# Altium schematic sheet Sch,SafetySystem.SchDoc
size B; SheetNumber: 1; SheetTotal: 1
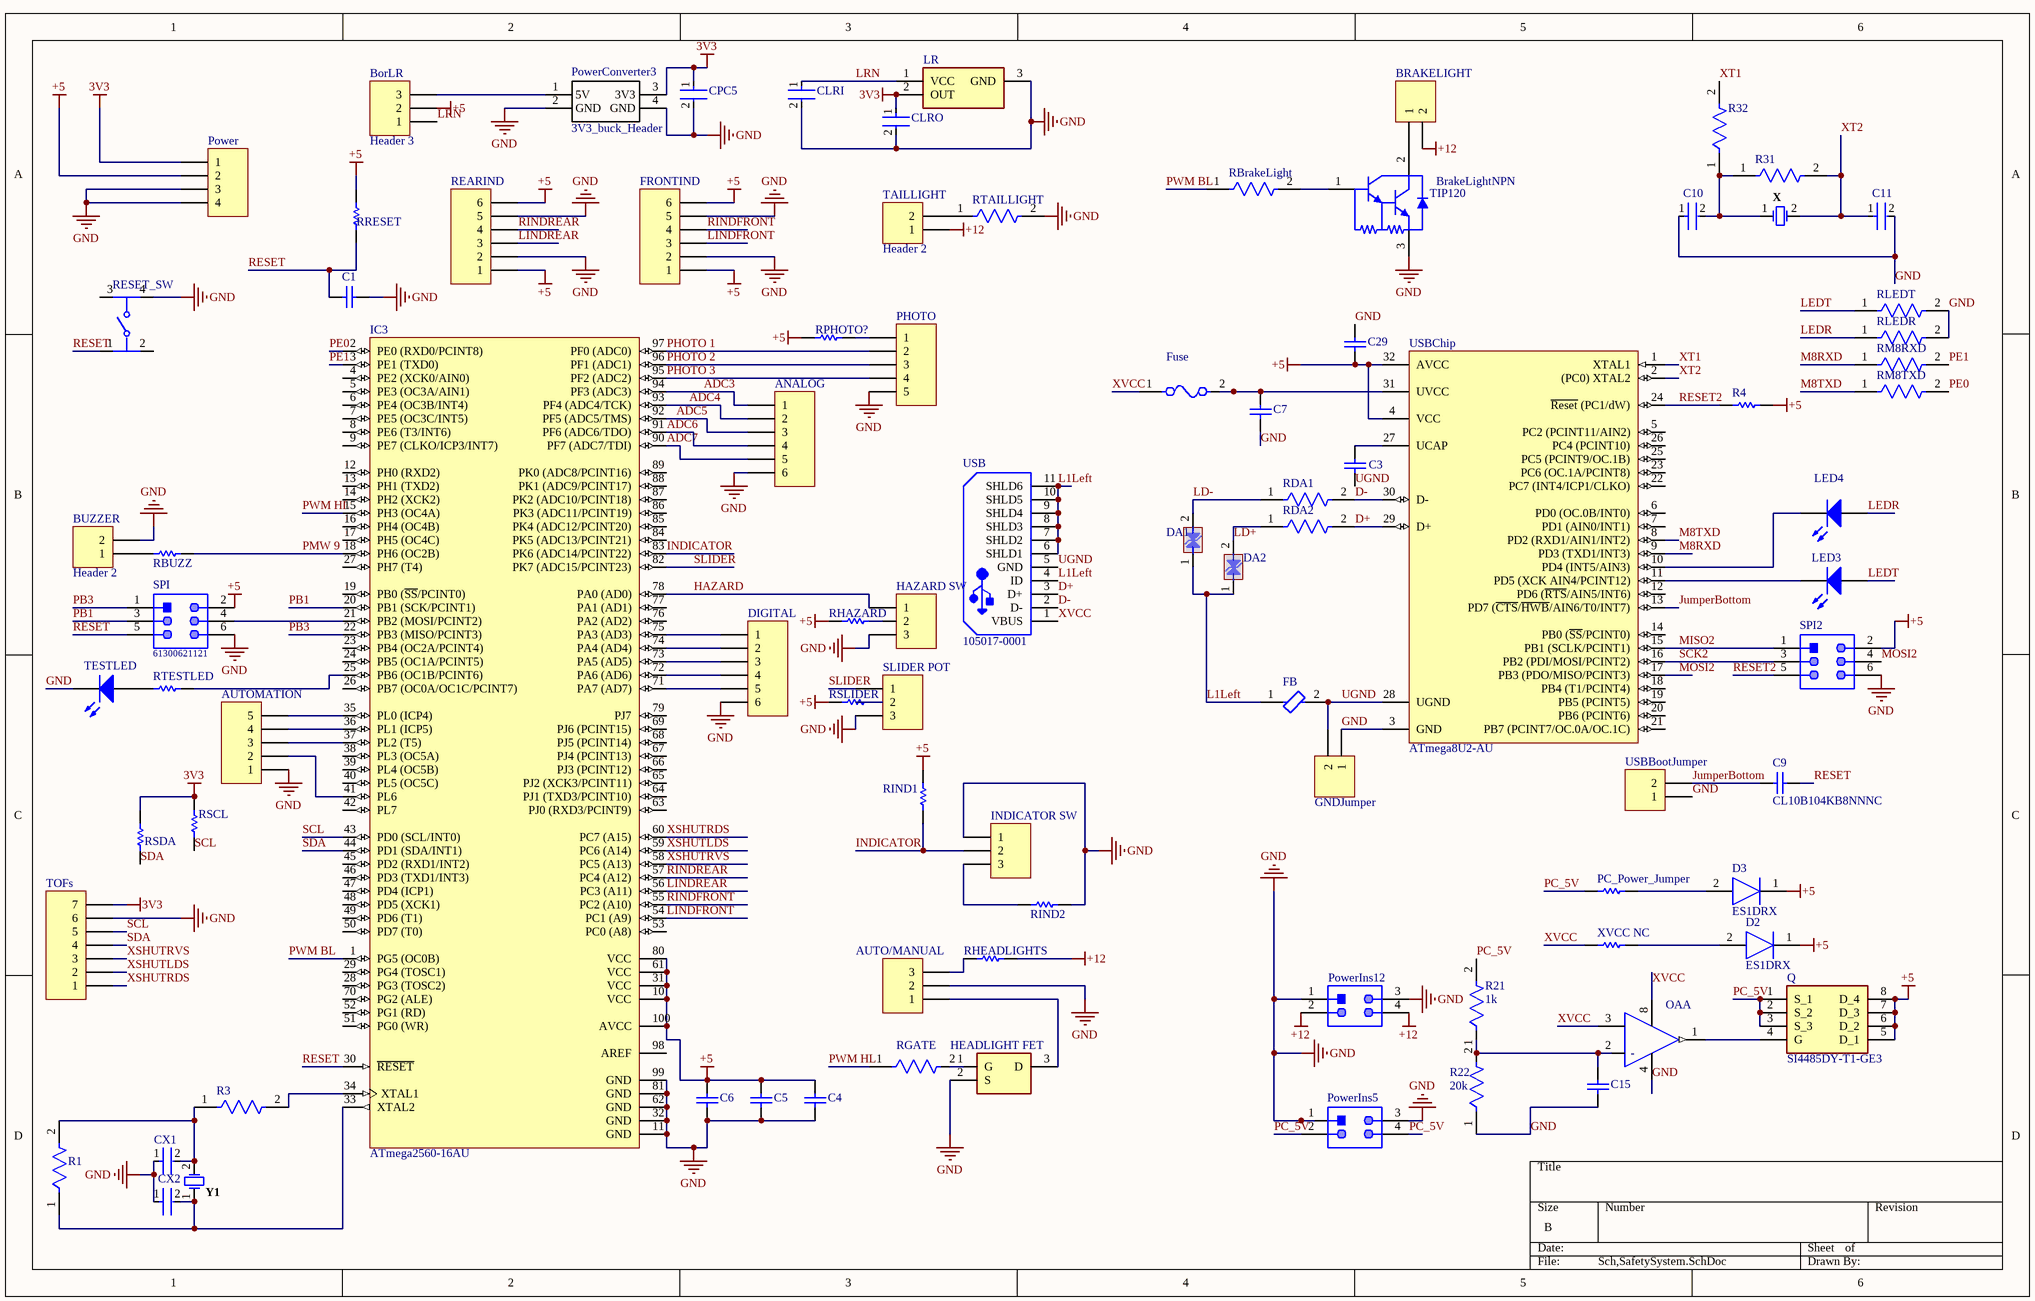
[diagram p0: Sch,SafetySystem.SchDoc]

## Parts
ANALOG  Header 6  [HDR1X6]  (value not drawn)
AUTO/MANUAL  (no value)  [HDR1X3]
AUTOMATION  Header 5  [HDR1X5]  (value not drawn)
BorLR  Header 3  [HDR1X3]
BRAKELIGHT  Header 2  [HDR1X2]  (value not drawn)
BrakeLightNPN  TIP120  [ONSC-TO-220-3-221A-09]
BUZZER  Header 2  [HDR1X2]
C1  GRM1885C1H220JA01D  [CAPC1608X90X35ML10T15]  (value not drawn)
C3  (no value)  [CAPC1608X90X35ML15T15]
C4  06035C104K4T2A  [CAPC1608X90X35ML15T15]  (value not drawn)
C5  06035C104K4T2A  [CAPC1608X90X35ML15T15]  (value not drawn)
C6  06035C104K4T2A  [CAPC1608X90X35ML15T15]  (value not drawn)
C7  06035C104K4T2A  [CAPC1608X90X35ML15T15]  (value not drawn)
C9  CL10B104KB8NNNC  [SAMS-C0603-2_M]
C10  C0603C220J5GACTU  [FP-C0603C-CF-MFG]  (value not drawn)
C11  C0603C220J5GACTU  [FP-C0603C-CF-MFG]  (value not drawn)
C15  06035C104K4T2A  [CAPC1608X90X35ML15T15]  (value not drawn)
C29  06035C104K4T2A  [CAPC1608X90X35ML15T15]  (value not drawn)
CLRI  C1608X5R1A106K080AC  [FP-C1608-080-MFG]  (value not drawn)
CLRO  C1608X5R1A106K080AC  [FP-C1608-080-MFG]  (value not drawn)
CPC5  C1608X5R1A106K080AC  [FP-C1608-080-MFG]  (value not drawn)
CX1  C0603C220J5GACTU  [FP-C0603C-CF-MFG]  (value not drawn)
CX2  C0603C220J5GACTU  [FP-C0603C-CF-MFG]  (value not drawn)
D2  ES1DRX  [SODFL3517X110N]
D3  ES1DRX  [SODFL3517X110N]
DA1  82356050101  [0603]  (value not drawn)
DA2  82356050101  [0603]  (value not drawn)
DIGITAL  Header 6  [HDR1X6]  (value not drawn)
FB  BLM18AG601SN1D  [FP-BLM18-0_15-t0_8-MFG]  (value not drawn)
FRONTIND  Header 6  [HDR1X6]  (value not drawn)
Fuse  0154.500DRT  [FP-0154-MFG]  (value not drawn)
GNDJumper  Header 2  [HDR1X2]  (value not drawn)
HAZARD_SW  (no value)  [HDR1X3]
HEADLIGHT_FET  ZXMN2B01F  [SOT95P237X112-3N]  (value not drawn)
IC3  ATmega2560-16AU  [100A_M]
INDICATOR_SW  SLIDER POT  [HDR1X3]  (value not drawn)
LED3  150060YS75000  [0603_A]  (value not drawn)
LED4  150060YS75000  [0603_A]  (value not drawn)
LR  BA033CC0FP-E2  [ROHM_TO-252-3]  (value not drawn)
OA  LM358DR  [FP-D0008A-MFG]  (value not drawn)  (part A of 2)
PC_Power_Jumper  CRCW06030000Z0EA  [RESC1609X50X30NL8T20]  (value not drawn)
PHOTO  Header 5  [HDR1X5]  (value not drawn)
Power  Header 4  [HDR1X4]  (value not drawn)
PowerConverter3  3V3_buck_Header  [PCBComponent_1]
PowerIns5  64900421122  [64900421122]  (value not drawn)
PowerIns12  64900421122  [64900421122]  (value not drawn)
Q  SI4485DY-T1-GE3  [SOIC127P600X175-8N]
R1  CRCW06031M00FKEA  [FP-CRCW0603-e3-MFG]  (value not drawn)
R3  CRCW060327R0FKEA  [FP-CRCW0603-e3-IPC_B]  (value not drawn)
R4  TNPW060310K0BEEA  [RESC1609X55X30NL10T20]  (value not drawn)
R21  1k  [FP-CRCW0603-e3-MFG]
R22  20k  [FP-CRCW0603-e3-IPC_C]
R31  (no value)  [FP-CRCW0603-e3-MFG]
R32  (no value)  [FP-CRCW0603-HPe3-IPC_B]
RBrakeLight  CRCW06031K00FKEA  [FP-CRCW0603-e3-MFG]  (value not drawn)
RBUZZ  CRCW06030000Z0EA  [RESC1609X50X30NL8T20]  (value not drawn)
RDA1  CRCW060322R0FKEA  [FP-CRCW0603-e3-IPC_B]  (value not drawn)
RDA2  CRCW060322R0FKEA  [FP-CRCW0603-e3-IPC_B]  (value not drawn)
REARIND  Header 6  [HDR1X6]  (value not drawn)
RESET_SW  B3FS-1000P  [FP-B3FS-1000P-MFG]  (value not drawn)
RGATE  CRCW060327R0FKEA  [FP-CRCW0603-e3-IPC_B]  (value not drawn)
RHAZARD  CRCW06030000Z0EA  [RESC1609X50X30NL8T20]  (value not drawn)
RHEADLIGHTS  CRCW06030000Z0EA  [RESC1609X50X30NL8T20]  (value not drawn)
RIND1  ERJ3EKF1002V  [RESC1609X55X30LL15T15]  (value not drawn)
RIND2  ERJ3EKF1002V  [RESC1609X55X30LL15T15]  (value not drawn)
RLEDR  ERA-3AEB102V  [FP-ERA3A-IPC_C]  (value not drawn)
RLEDT  ERA-3AEB102V  [FP-ERA3A-IPC_C]  (value not drawn)
RM8RXD  ERA-3AEB102V  [FP-ERA3A-IPC_C]  (value not drawn)
RM8TXD  ERA-3AEB102V  [FP-ERA3A-IPC_C]  (value not drawn)
RPHOTO?  10kohm  [RESC1609X50X30NL8T20]  (value not drawn)
RRESET  ERJ3EKF1002V  [RESC1609X55X30LL15T15]  (value not drawn)
RSCL  10kohm  [RESC1609X50X30NL8T20]  (value not drawn)
RSDA  CRCW06030000Z0EA  [RESC1609X50X30NL8T20]  (value not drawn)
RSLIDER  CRCW06030000Z0EA  [RESC1609X50X30NL8T20]  (value not drawn)
RTAILLIGHT  ERJ-3EKF10R0V  [FP-ERJ3EK-MFG]  (value not drawn)
RTESTLED  TNPW06031K00BEEA  [RESC1609X55X30LL10T20]  (value not drawn)
SLIDER_POT  SLIDER POT  [HDR1X3]  (value not drawn)
SPI  61300621121  [61300621121]
SPI2  61300621121  [61300621121]  (value not drawn)
TAILLIGHT  Header 2  [HDR1X2]
TESTLED  BlinkTestLED  [0603_A]  (value not drawn)
TOFs  Header 7  [HDR1X7]  (value not drawn)
USB  105017-0001  [USB-MICRO-B_V]
USBBootJumper  Header 2  [HDR1X2]  (value not drawn)
USBChip  ATmega8U2-AU  [32A_M]
X  FOXSLF/160-20  [FOX-FOXSLF160-20]  (value not drawn)
XVCC_NC  CRCW06030000Z0EA  [RESC1609X50X30NL8T20]  (value not drawn)
Y1  FOXSLF/160-20  [FOX-FOXSLF160-20]  (value not drawn)

## Nets
3V3: CLRO.1 CPC5.1 LR.2(OUT) Power.1 PowerConverter3.3(3V3) RSCL.1 RSDA.1 TOFs.7
+5: BorLR.2 C4.2 C5.2 C6.2 C29.1 D2.1(K) D3.1(K) FRONTIND.1 FRONTIND.6 IC3.10(VCC) IC3.31(VCC) IC3.61(VCC) IC3.80(VCC) IC3.100(AVCC) Power.2 Q.5(D_1) Q.6(D_2) Q.7(D_3) Q.8(D_4) R4.2 REARIND.1 REARIND.6 RHAZARD.1 RIND1.1 RPHOTO?.1 RRESET.2 RSLIDER.1 SPI.2 SPI2.2 USBChip.4(VCC) USBChip.32(AVCC)
+12: BRAKELIGHT.2 PowerIns12.2 PowerIns12.4 RHEADLIGHTS.2 TAILLIGHT.1
GND: ANALOG.6 AUTO/MANUAL.2 AUTOMATION.1 BrakeLightNPN.3(E) BUZZER.2 C1.2 C4.1 C5.1 C6.1 C7.1 C10.1 C11.2 C15.1 C29.2 CLRI.2 CLRO.2 CPC5.2 CX1.1 CX2.1 DIGITAL.6 FRONTIND.2 FRONTIND.5 GNDJumper.1 HAZARD_SW.3 HEADLIGHT_FET.2(S) IC3.11(GND) IC3.32(GND) IC3.62(GND) IC3.81(GND) IC3.99(GND) INDICATOR_SW.1 LR.3(GND) OA.4(V-) PHOTO.5 Power.3 Power.4 PowerConverter3.2(GND) PowerConverter3.4(GND) PowerIns5.1 PowerIns5.3 PowerIns12.1 PowerIns12.3 R22.1 REARIND.2 REARIND.5 RESET_SW.4 RIND2.2 RLEDR.2 RLEDT.2 RTAILLIGHT.2 SLIDER_POT.3 SPI.6 SPI2.6 TESTLED.1(K) TOFs.6 USBBootJumper.1 USBChip.3(GND)
ADC3: ANALOG.1 IC3.94(PF3_(ADC3))
ADC4: ANALOG.2 IC3.93(PF4_(ADC4/TCK))
ADC5: ANALOG.3 IC3.92(PF5_(ADC5/TMS))
ADC6: ANALOG.4 IC3.91(PF6_(ADC6/TDO))
ADC7: ANALOG.5 IC3.90(PF7_(ADC7/TDI))
D+: RDA2.2 USB.3(D+) USBChip.29(D+)
D-: RDA1.2 USB.2(D-) USBChip.30(D-)
HAZARD: HAZARD_SW.1 IC3.78(PA0_(AD0))
INDICATOR: IC3.83(PK6_(ADC14/PCINT22)) INDICATOR_SW.2 RIND1.2
JumperBottom: C9.1 USBBootJumper.2 USBChip.13(PD7_(~{CTS}/~{HWB}/AIN6/T0/INT7))
L1Left: DA1.1(I/O1) DA2.1(I/O1) FB.1 USB.4(ID) USB.6(SHLD1) USB.7(SHLD2) USB.8(SHLD3) USB.9(SHLD4) USB.10(SHLD5) USB.11(SHLD6)
LD+: DA2.2(I/O2) RDA2.1
LD-: DA1.2(I/O2) RDA1.1
LEDR: LED4.2(A) RLEDR.1
LEDT: LED3.2(A) RLEDT.1
LINDFRONT: FRONTIND.3 IC3.54(PC1_(A9))
LINDREAR: IC3.56(PC3_(A11)) REARIND.3
LRN: BorLR.1 CLRI.1 LR.1(VCC)
M8RXD: RM8RXD.1 USBChip.9(PD3_(TXD1/INT3))
M8TXD: RM8TXD.1 USBChip.8(PD2_(RXD1/AIN1/INT2))
MISO2: SPI2.1 USBChip.15(PB1_(SCLK/PCINT1))
MOSI2: SPI2.4 USBChip.17(PB3_(PDO/MISO/PCINT3))
PB1: IC3.20(PB1_(SCK/PCINT1)) SPI.3
PB3: IC3.22(PB3_(MISO/PCINT3)) SPI.1
PC_5V: PC_Power_Jumper.1 PowerIns5.2 PowerIns5.4 Q.1(S_1) Q.2(S_2) Q.3(S_3) R21.2
PE0: IC3.2(PE0_(RXD0/PCINT8)) RM8TXD.2
PE1: IC3.3(PE1_(TXD0)) RM8RXD.2
PHOTO 1: IC3.97(PF0_(ADC0)) PHOTO.2
PHOTO 2: IC3.96(PF1_(ADC1)) PHOTO.3
PHOTO 3: IC3.95(PF2_(ADC2)) PHOTO.4
PMW 9: IC3.18(PH6_(OC2B)) RBUZZ.1
PWM BL: IC3.1(PG5_(OC0B)) RBrakeLight.1
PWM HL: IC3.15(PH3_(OC4A)) RGATE.1
RESET: C1.1 C9.2 IC3.30(~{RESET}) RESET_SW.1 RRESET.1 SPI.5
RESET2: R4.1 SPI2.5 USBChip.24(~{Reset}_(PC1/dW))
RINDFRONT: FRONTIND.4 IC3.55(PC2_(A10))
RINDREAR: IC3.57(PC4_(A12)) REARIND.4
SCK2: SPI2.3 USBChip.16(PB2_(PDI/MOSI/PCINT2))
SCL: IC3.43(PD0_(SCL/INT0)) RSCL.2 TOFs.5
SDA: IC3.44(PD1_(SDA/INT1)) RSDA.2 TOFs.4
SLIDER: IC3.82(PK7_(ADC15/PCINT23)) SLIDER_POT.1
UGND: C3.1 FB.2 GNDJumper.2 USB.5(GND) USBChip.28(UGND)
XSHUTLDS: IC3.59(PC6_(A14)) TOFs.2
XSHUTRDS: IC3.60(PC7_(A15)) TOFs.1
XSHUTRVS: IC3.58(PC5_(A13)) TOFs.3
XT1: R32.2 USBChip.1(XTAL1)
XT2: C11.1 R31.2 USBChip.2((PC0)_XTAL2) X.2
XVCC: Fuse.1 OA.3(IN1+) OA.8(V+) USB.1(VBUS) XVCC_NC.1
NetAUTO/MANUAL_1: AUTO/MANUAL.1 HEADLIGHT_FET.3(D)
NetAUTO/MANUAL_3: AUTO/MANUAL.3 RHEADLIGHTS.1
NetAUTOMATION_2: AUTOMATION.2 IC3.41(PL6)
NetAUTOMATION_3: AUTOMATION.3 IC3.37(PL2_(T5))
NetAUTOMATION_4: AUTOMATION.4 IC3.36(PL1_(ICP5))
NetAUTOMATION_5: AUTOMATION.5 IC3.35(PL0_(ICP4))
NetBorLR_3: BorLR.3 PowerConverter3.1(5V)
NetBRAKELIGHT_1: BRAKELIGHT.1 BrakeLightNPN.2(C)
NetBrakeLightNPN_1: BrakeLightNPN.1(B) RBrakeLight.2
NetBUZZER_1: BUZZER.1 RBUZZ.2
NetC3_2: C3.2 USBChip.27(UCAP)
NetC7_2: C7.2 Fuse.2 USBChip.31(UVCC)
NetC10_2: C10.2 R31.1 R32.1 X.1
NetC15_2: C15.2 OA.2(IN1-) R21.1 R22.2
NetCX1_2: CX1.2 R1.2 R3.1 Y1.2
NetCX2_2: CX2.2 IC3.33(XTAL2) R1.1 Y1.1
NetD2_2: D2.2(A) XVCC_NC.2
NetD3_2: D3.2(A) PC_Power_Jumper.2
NetDIGITAL_1: DIGITAL.1 IC3.75(PA3_(AD3))
NetDIGITAL_2: DIGITAL.2 IC3.74(PA4_(AD4))
NetDIGITAL_3: DIGITAL.3 IC3.73(PA5_(AD5))
NetDIGITAL_4: DIGITAL.4 IC3.72(PA6_(AD6))
NetDIGITAL_5: DIGITAL.5 IC3.71(PA7_(AD7))
NetHAZARD_SW_2: HAZARD_SW.2 RHAZARD.2
NetHEADLIGHT_FET_1: HEADLIGHT_FET.1(G) RGATE.2
NetIC3_21: IC3.21(PB2_(MOSI/PCINT2)) SPI.4
NetIC3_25: IC3.25(PB6_(OC1B/PCINT6)) RTESTLED.2
NetIC3_34: IC3.34(XTAL1) R3.2
NetINDICATOR_SW_3: INDICATOR_SW.3 RIND2.1
NetLED3_1: LED3.1(K) USBChip.11(PD5_(XCK_AIN4/PCINT12))
NetLED4_1: LED4.1(K) USBChip.10(PD4_(INT5/AIN3))
NetOA_1: OA.1(1OUT) Q.4(G)
NetPHOTO_1: PHOTO.1 RPHOTO?.2
NetRSLIDER_2: RSLIDER.2 SLIDER_POT.2
NetRTAILLIGHT_1: RTAILLIGHT.1 TAILLIGHT.2
NetRTESTLED_1: RTESTLED.1 TESTLED.2(A)

Not connected (* = marked no-connect by the designer): IC3 4(PE2_(XCK0/AIN0)) 5(PE3_(OC3A/AIN1)) 6(PE4_(OC3B/INT4)) 7(PE5_(OC3C/INT5)) 8(PE6_(T3/INT6)) 9(PE7_(CLKO/ICP3/INT7)) 12(PH0_(RXD2)) 13(PH1_(TXD2)) 14(PH2_(XCK2)) 16(PH4_(OC4B)) 17(PH5_(OC4C)) 19(PB0_(~{SS}/PCINT0)) 23(PB4_(OC2A/PCINT4)) 24(PB5_(OC1A/PCINT5)) 26(PB7_(OC0A/OC1C/PCINT7)) 27(PH7_(T4)) 28(PG3_(TOSC2)) 29(PG4_(TOSC1)) 38(PL3_(OC5A)) 39(PL4_(OC5B)) 40(PL5_(OC5C)) 42(PL7) 45(PD2_(RXD1/INT2)) 46(PD3_(TXD1/INT3)) 47(PD4_(ICP1)) 48(PD5_(XCK1)) 49(PD6_(T1)) 50(PD7_(T0)) 51(PG0_(WR)) 52(PG1_(RD)) 53(PC0_(A8)) 63(PJ0_(RXD3/PCINT9)) 64(PJ1_(TXD3/PCINT10)) 65(PJ2_(XCK3/PCINT11)) 66(PJ3_(PCINT12)) 67(PJ4_(PCINT13)) 68(PJ5_(PCINT14)) 69(PJ6_(PCINT15)) 70(PG2_(ALE)) 76(PA2_(AD2)) 77(PA1_(AD1)) 79(PJ7) 84(PK5_(ADC13/PCINT21)) 85(PK4_(ADC12/PCINT20)) 86(PK3_(ADC11/PCINT19)) 87(PK2_(ADC10/PCINT18)) 88(PK1_(ADC9/PCINT17)) 89(PK0_(ADC8/PCINT16)) 98(AREF); RESET_SW 2 3; USBChip 5(PC2_(PCINT11/AIN2)) 6(PD0_(OC.0B/INT0)) 7(PD1_(AIN0/INT1)) 12(PD6_(~{RTS}/AIN5/INT6)) 14(PB0_(~{SS}/PCINT0)) 18(PB4_(T1/PCINT4)) 19(PB5_(PCINT5)) 20(PB6_(PCINT6)) 21(PB7_(PCINT7/OC.0A/OC.1C)) 22(PC7_(INT4/ICP1/CLKO)) 23(PC6_(OC.1A/PCINT8)) 25(PC5_(PCINT9/OC.1B)) 26(PC4_(PCINT10))

## Notes on the sheet
- (in symbol CMP-1685-00009-2, part A) -

## Library data of the parts
ANALOG DIGITAL FRONTIND REARIND = Header 6: Header, 6-Pin; LatestRevisionDate: 17-Jul-2002; LatestRevisionNote: Re-released for DXP Platform.; Publisher: Altium Limited
AUTO/MANUAL BorLR HAZARD_SW INDICATOR_SW SLIDER_POT = Header 3: Header, 3-Pin; LatestRevisionDate: 17-Jul-2002; LatestRevisionNote: Re-released for DXP Platform.; Publisher: Altium Limited
AUTOMATION PHOTO = Header 5: Header, 5-Pin; LatestRevisionDate: 17-Jul-2002; LatestRevisionNote: Re-released for DXP Platform.; Publisher: Altium Limited
BRAKELIGHT BUZZER GNDJumper TAILLIGHT USBBootJumper = Header 2: Header, 2-Pin; LatestRevisionDate: 17-Jul-2002; LatestRevisionNote: Re-released for DXP Platform.; Publisher: Altium Limited
BrakeLightNPN = CMP-1047-00140-1: Plastic Medium-Power, Complementary Silicon Transistor, 3-Pin TO-220, Tube; Manufacturer: On Semiconductor; IC Continuous (A): 5; Polarity: NPN; ComponentLink2URL: http://www.onsemi.cn/pub_link/Collateral/TIP120-D.PDF; Packing: Tube; PartNumber: TIP120; ComponentLink3Description: Package Specification; PackageDescription: 3-Pin Flange Mount, Vertical Straight Lead, Body 9.97 x 4.445 mm, Pitch 2.54 mm; Mounting Technology: Through Hole; ComponentLink1URL: http://www.onsemi.com/; PackageVersion: Rev. AG, 09/2011; ComponentLink1Description: Manufacturer URL; PackageReference: TO-220-3-221A-09; ComponentLink2Description: Datasheet; RoHS: FALSE; DatasheetVersion: Rev. 8; ComponentLink3URL: http://www.onsemi.com/pub_link/Collateral/221A-09.PDF
C1 = CMP-2000-04945-1: Chip Capacitor, 22 pF, +/- 5%, 50 V, -55 to 125 degC, 0603 (1608 Metric), RoHS, Tape and Reel; Manufacturer: Murata; Capacitance: 22pF; Rated Voltage: 50V; Dielectric: C0G; Manufacturer URL: http://www.murata.com/; Datasheet Version: Jul-06; Package Reference: 603; Tolerance (%): ±5%; Case Size/Dimension: 0603; Package Description: 2-Pin Surface Mount Device, Body 1.6 x 0.8 mm; Datasheet URL: https://datasheet.ciiva.com/11786/0900766b807a1cab-11786398.pdf
C3 = CMP-2006-04386-1: Part Number: 06035C104K4T2A; Manufacturer: AVX Interconnect / Elco
C4-C7 C15 C29 = CMP-2006-04386-1: Manufacturer: AVX Interconnect / Elco; Part Number: 06035C104K4T2A
C9 = CMP-2000-05332-1: Multi-layer Ceramic Capacitor, -55 to 125 degC, 2-Pin SMD (0603), RoHS, Tape and Reel; Manufacturer: Samsung Electro-Mechanics; Capacitance: 0.1µF; Rated Voltage: 50V; Dielectric: X7R; Tolerance (%): ±10%; Case Size/Dimension: 0603; Datasheet URL: https://datasheet.ciiva.com/29198/456651-da-01-en-vs-kondensator-0605-29198839.pdf; Manufacturer URL: http://www.samsungsem.com/global/index.jsp; Datasheet Version: Nov-10
C10 C11 CX1 CX2 = CMP-2006-03119-3: Cap Ceramic 22pF 50V C0G 5% SMD 0603 125°C Paper T/R; Manufacturer: KEMET; Temperature Coefficient: 30ppm/°C; Automotive Grade: Grade 1; Tolerance: 0.05; RoHS: TRUE; Temperature Characteristic: C0G; Capacitance: 22 pF; Device Class L3: Ceramic Capacitors; Digikey Description: Cap Ceramic 22pF 50V C0G 5% SMD 0603 125°C Paper T/R; ComponentLink2URL: https://api.kemet.com/component-edge/download/datasheet/C0603C100J5GACAUTO.pdf; ComponentLink2Description: Datasheet; Automotive: Yes; Temperature: -55°C to +125°C; Temperature Range High: +125°C; Package: C0603C-CF; Device Class L1: Passive Components; Device Class L2: Capacitors; Lead Free: Yes; Value: 22 pF; Manufacturer Part Number: C0603C220J5GACTU; Category: Cap; Mouser Description: Cap Ceramic 22pF 50V C0G 5% SMD 0603 125°C Paper T/R; Voltage Rating: 50 V; Height: 0.87mm; Material: Ceramic; Temperature Range Low: -55°C; Octopart: https://octopart.com/c0603c220j5gactu-kemet-98525
CLRI CLRO CPC5 = CMP-2000-04979-2: CAP CER 10UF 10V X5R 0603; Manufacturer: TDK; Temperature Coefficient: 15%; Tolerance: 10%; Mouser Description: CAP CER 10UF 10V X5R 0603; Package: C1608-080; Lead Free: Yes; Device Class L1: Passive Components; Value: 10uF; Temperature Range High: +85°C; Manufacturer Part Number: C1608X5R1A106K080AC; Octopart: https://octopart.com/c1608x5r1a106k080ac-tdk-26013468; Voltage: 10V; Footprint Url: https://product.tdk.com/info/en/catalog/spec/mlccspec_commercial_general_midvoltage_en.pdf; Ipc Land Pattern Name: CAPC16080X80; Temperature Range Low: -55°C; Temperature: -55°C to +85°C; ComponentLink2Description: Datasheet; ComponentLink2URL: https://product.tdk.com/info/en/documents/chara_sheet/C1608X5R1A106K080AC.pdf; Height: 0.9mm; Temperature Characteristic: X5R; RoHS: TRUE; Category: Cap; Capacitance: 10uF; Digikey Description: CAP CER 10UF 10V X5R 0603; Automotive: No; Device Class L3: Ceramic Capacitors; Material: Ceramic; Device Class L2: Capacitors; Voltage Rating: 10V
D2 D3 = ES1DRX: Diode; Manufacturer_Name: Nexperia; Datasheet Link: http://www.farnell.com/datasheets/2363499.pdf; Height: 1.1mm; Manufacturer_Part_Number: ES1DRX; Mouser Part Number: N/A; Mouser Price/Stock: https://www.mouser.com/Search/Refine.aspx?Keyword=N%2FA; Arrow Part Number: ES1DRX; Arrow Price/Stock: https://www.arrow.com/en/products/es1drx/nexperia
DA1 DA2 = CMP-1422-00010-1: ESD Suppressor WE-VE,VDC=5.0V; Manufacturer: Wuerth Elektronik; Reverse Stand Off Voltage: 5.0V; ComponentLink2URL: http://katalog.we-online.de/kataloge/eisos/media/pdf/82356050101.pdf; PackageReference: 0603; PartNumber: 82356050101; ComponentLink1URL: http://www.we-online.com; ComponentLink1Description: Manufacturer URL; ComponentLink2Description: Datasheet
FB = CMP-0686-00436-3: Chip Ferrite Bead, 0603, 600Ω @ 100MHz, 0.38Ω, 25%, 500mA; Number of Lines: 1; Impedance: 600R; DC Resistance (DCR): 380mR; Shielding: Unshielded; Max DC Current: 500mA; Termination: SMD/SMT; Military Standard: Not; Number of Circuits: 1; Min Operating Temperature: -55°C; Case Code (Imperial): 0603; Width: 0.8mm; Current Rating: 500mA; Lead Free: Lead Free; Packaging: Tape and Reel; Frequency: 100MHz; Max Operating Temperature: 125°C; DC Current: 500mA; REACH SVHC: No SVHC; Case/Package: 0603; Package Quantity: 1; Height: 0.8mm; Number of Pins: 2; Depth: 0.8mm; Test Frequency: 100MHz; Case Code (Metric): 1608; Tolerance: 25%; Core Material: Ferrite; Weight: 7.1E-05oz; Material: Steel; Max Current Rating: 500mA; Radiation Hardening: No; Length: 1.6mm; RoHS Compliant: Yes
Fuse = CMP-08605-000021-1: FUSE BOARD MNT 500MA 125VAC/VDC; Manufacturer: Littelfuse; Max Fuse Ac Voltage: 125V; Fuse Blow Speed: Slow; Fuse Current: 0.5A; Fuse I2T: 0.24A2Sec; Package: 0154; Automotive: No; ComponentLink2URL: https://www.littelfuse.com/~/media/electronics/datasheets/fuses/littelfuse_fuse_154_154t_154l_154tl_datasheet.pdf.pdf; RoHS: TRUE; Octopart: https://octopart.com/0154.500drt-littelfuse-565915; Device Class L2: Fuses; Temperature: -55°C to +125°C; Manufacturer Part Number: 0154.500DRT; Temperature Range Low: -55°C; Device Class L1: Circuit Protection; Temperature Range High: +125°C; Mouser Description: Surface Mount Fuses Fuseblck w/ fuse .5A OMNI BLOK 154T; Lead Free: Yes; ComponentLink2Description: Datasheet; Digikey Description: FUSE BOARD MNT 500MA 125VAC/VDC; Height: 3.81mm; Device Class L3: unset; Max Fuse Dc Voltage: 125V; Category: Fuse
HEADLIGHT_FET = ZXMN2B01F: Undefined or Miscellaneous; Manufacturer_Name: Diodes Inc.; Manufacturer_Part_Number: ZXMN2B01F
IC3 = CMP-0095-00210-2: 8-bit AVR Microcontroller, 4.5-5.5V, 16MHz, 256KB Flash, 4KB EEPROM, 8KB SRAM, 86 GPIO pins, 100-pin TQFP, Industrial Grade (-40°C to 85°C), Pb-Free; PackageDescription: 100-Pin Thin Profile Plastic Quad Flat Pack (TQFP), 14 x 14 x 1.0 mm Body, 0.5 mm Pitch; ComponentLink1Description: Manufacturer URL; ComponentLink3URL: http://www.atmel.com/dyn/resources/prod_documents/2549S.pdf; RevisionNote: DatasheetVersion & PackageVersion updated. URLs added.; DatasheetVersion: revN, May-2011; ComponentLink2Description: ATmega640/1280/1281/2560/2561 Datasheet; PackageReference: 100A; PackageVersion: revD, Oct-2010; Code_JEDEC: MS-026-AED; ComponentLink1URL: http://www.atmel.com/; ComponentLink2URL: http://www.atmel.com/dyn/resources/prod_documents/doc2549.pdf; ComponentLink3Description: ATmega640/1280/1281/2560/2561 Summary
LED3 LED4 = CMP-1426-00005-1: SMD mono-color Chip LED, WL-SMCW, Yellow; Manufacturer: Wuerth Elektronik; ComponentLink1URL: http://www.we-online.com; PartNumber: 150060YS75000; Color: Yellow; ComponentLink2Description: Datasheet; ComponentLink2URL: http://katalog.we-online.com/led/datasheet/150060YS75000.pdf; ComponentLink1Description: Manufacturer URL; PackageReference: 0603_A
LR = BA033CC0FP-E2: Integrated Circuit; Manufacturer_Name: ROHM Semiconductor; Datasheet Link: http://rohmfs.rohm.com/en/products/databook/datasheet/ic/power/linear_regulator/baxxdd0-e.pdf; Manufacturer_Part_Number: BA033CC0FP-E2; Mouser Part Number: 755-BA033CC0FP-E2; Mouser Price/Stock: https://www.mouser.co.uk/ProductDetail/ROHM-Semiconductor/BA033CC0FP-E2?qs=4kLU8WoGk0vZtk7EcED04A%3D%3D; Arrow Part Number: BA033CC0FP-E2; Arrow Price/Stock: https://www.arrow.com/en/products/ba033cc0fp-e2/rohm-semiconductor?region=nac
OA = CMP-1685-00009-2: IC OPAMP GP 2 CIRCUIT 8SOIC; Output Current: 30mA; Min Dual Supply Voltage: 1.5V; Input Offset Voltage (Vos): 7mV; Power Supply Rejection Ratio (PSRR): 65dB; Unity Gain Bandwidth Product: 700kHz; Number of Channels: 2; Min Supply Voltage: 3V; Max Dual Supply Voltage: 16V; Dual Supply Voltage: 9V; Max Supply Voltage: 32V; Nominal Supply Current: 1.2mA; Slew Rate: 0.3V/µs; Input Bias Current: 250nA; Voltage Gain: 100dB; Operating Supply Current: 1mA; REACH SVHC: No SVHC; Package Quantity: 2500; Width: 3.91mm; Max Operating Temperature: 70°C; Min Operating Temperature: 0°C; Mount: Surface Mount; Length: 4.9mm; Radiation Hardening: No; Case/Package: SOIC; Lead Free: Lead Free; Number of Elements: 2; Packaging: Tape and Reel; Output Current per Channel: 30mA; Number of Circuits: 2; Bandwidth: 700kHz; Operating Supply Voltage: 16V; Gain Bandwidth Product: 700kHz; Number of Pins: 8; Number of Amplifiers: 2; Height: 1.58mm; Common Mode Rejection Ratio: 65dB; Contact Plating: Gold
PC_Power_Jumper RBUZZ RHAZARD RHEADLIGHTS RPHOTO? RSCL RSDA RSLIDER XVCC_NC = CMP-2000-03816-5: Chip Resistor, 0 Ohm, Jumper, 100 mW, -55 to 155 degC, 0603 (1608 Metric), RoHS, Tape and Reel; Manufacturer: Vishay Semiconductor; Voltage Rating: 75 V; Package Quantity: 5000; DatasheetVersion: 06/2012; Min Operating Temperature: -55 degC; ComponentLink1URL: http://www.vishay.com/; Mounting Technology: Surface Mount; Height: 0.45 mm; ComponentLink1Description: Manufacturer URL; REACH SVHC: Unknown; PackageReference: 0603; Packaging: Tape and Reel; Max Operating Temperature: 155 degC; Mount: Surface Mount; ComponentLink2Description: Datasheet; PackageDescription: 2-Pin Surface Mount Device, Body 1.575 x 0.85 mm; Length: 1.55 mm; ComponentLink2URL: http://www.vishay.com/docs/20035/dcrcwe3.pdf; Pins: 2; RoHSCompliant: true
Power = Header 4: Header, 4-Pin; LatestRevisionDate: 17-Jul-2002; LatestRevisionNote: Re-released for DXP Platform.; Publisher: Altium Limited
PowerIns5 PowerIns12 = CMP-1502-00494-1: THT Male Header WR-MPC4, Vertical, Dual Row, pitch 4.2 mm, 4 pins; Manufacturer: Wurth Elektronik; Contact Resistance: 10mOhm; Pitch: 4.2mm; Working Voltage: 600VAC; Pin Number: 4; Operating Temperature: -40to105degC; Datasheet URL: https://katalog.we-online.de/em/datasheet/6490xx21122.pdf; Manufacturer URL: http://www.we-online.de; Package Reference: 64900421122; Publisher: WurthElektronik; Gender: Male; Mounting Technology: THT; Part Number: 64900421122; Packaging: Tray; Orientation: Vertical
Q = SI4485DY-T1-GE3: Integrated Circuit; Manufacturer_Name: Vishay; Datasheet Link: https://www.arrow.com/en/products/si4485dy-t1-ge3/vishay; Height: 1.75mm; Manufacturer_Part_Number: SI4485DY-T1-GE3; Mouser Part Number: 781-SI4485DY-T1-GE3; Mouser Price/Stock: https://www.mouser.co.uk/ProductDetail/Vishay-Semiconductors/SI4485DY-T1-GE3?qs=yQ4lPMPRQIrw%2Fu7lX1YS%2Fw%3D%3D; Arrow Part Number: SI4485DY-T1-GE3; Arrow Price/Stock: https://www.arrow.com/en/products/si4485dy-t1-ge3/vishay
R1 R31 = CMP-2000-03013-2: RES Thick Film, 1MΩ, 1%, 0.1W, 100ppm/°C, 0603; Max Power Dissipation: 100mW; Resistance: 1MR; Voltage Rating (DC): 75V; Depth: 0.85mm; Max Operating Temperature: 155°C; Length: 1.55mm; Power Rating: 100mW; Military Standard: Not; Features: Automotive AEC-Q200; Min Operating Temperature: -55°C; Number of Pins: 2; Mount: Surface Mount; Package Quantity: 10; Packaging: Tape and Reel; Height: 0.45mm; Radiation Hardening: No; Case Code (Metric): 1608; Temperature Coefficient: 100ppm/°C; Width: 0.85mm; Composition: Thick Film; Termination: SMD/SMT; Tolerance: 1%; Number of Terminations: 2; Lead Free: Lead Free; Contact Plating: Tin; Case/Package: 0603; Weight: 7.1E-05oz; Voltage Rating: 75V; Case Code (Imperial): 0603
R3 RGATE = CMP-2000-03144-2: RES Thick Film, 27Ω, 1%, 0.1W, 100ppm/°C, 0603; Power Rating: 100mW; Resistance: 27R; Voltage Rating (DC): 75V; Case Code (Metric): 1608; Length: 1.55mm; Lead Free: Lead Free; Military Standard: Not; Packaging: Tape and Reel; Termination: SMD/SMT; Width: 0.85mm; Radiation Hardening: No; Max Operating Temperature: 155°C; Package Quantity: 5000; Case/Package: 0603; Height: 0.45mm; Contact Plating: Tin; Min Operating Temperature: -55°C; Voltage Rating: 75V; Tolerance: 1%; Composition: Thick Film; Temperature Coefficient: 100ppm/°C; Case Code (Imperial): 0603; Weight: 7.1E-05oz; Number of Pins: 2; Depth: 0.85mm; Mount: Surface Mount
R4 = CMP-2000-03691-1: Manufacturer: Vishay Dale; Part Number: TNPW060310K0BEEA
R21 RBrakeLight = CMP-1666-00003-5: RES Thick Film, 1kΩ, 1%, 0.1W, 100ppm/°C, 0603; Max Power Dissipation: 100mW; Voltage Rating: 75V; Resistance: 1kR; Max Operating Temperature: 155°C; Number of Pins: 2; Case Code (Imperial): 0603; Width: 0.033inch; Power Rating: 100mW; Number of Terminations: 2; Package Quantity: 10; Weight: 7.1E-05oz; Tolerance: 1%; Temperature Coefficient: 100ppm/°C; Military Standard: Not; Mount: Surface Mount; Voltage Rating (DC): 75V; Depth: 0.85mm; Composition: Thick Film; Radiation Hardening: No; Termination: SMD/SMT; Length: 1.55mm; Case Code (Metric): 1608; Contact Plating: Tin; Min Operating Temperature: -55°C; Packaging: Tape and Reel; Height: 0.45mm; Lead Free: Lead Free; Case/Package: 0603; Features: Automotive AEC-Q200
R22 = CMP-2000-03068-2: RES Thick Film, 20kΩ, 1%, 0.1W, 100ppm/°C, 0603; Voltage Rating: 75V; Power Rating: 100mW; Resistance: 20kR; Lead Free: Lead Free; Depth: 0.85mm; Case Code (Metric): 1608; Contact Plating: Tin; Max Operating Temperature: 155°C; Package Quantity: 5000; Length: 1.55mm; Min Operating Temperature: -55°C; Composition: Thick Film; Case/Package: 0603; Packaging: Tape and Reel; Tolerance: 1%; Width: 0.85mm; Termination: SMD/SMT; Military Standard: Not; Case Code (Imperial): 0603; Voltage Rating (DC): 75V; Temperature Coefficient: 100ppm/°C; Radiation Hardening: No; Weight: 7.1E-05oz; Height: 0.45mm; Number of Pins: 2; Mount: Surface Mount
R32 = CMP-02407-007306-1: RES Thick Film, 27Ω, 1%, 0.33W, 100ppm/°C, 0603; Resistance: 27R; Power Rating: 250mW; Voltage Rating: 75V; Termination: SMD/SMT; Lead Free: Lead Free; Max Power Dissipation: 250mW; Length: 1.6mm; Features: Automotive AEC-Q200; Voltage Rating (DC): 75V; Package Quantity: 5000; Mount: Surface Mount; Case Code (Imperial): 0603; Case Code (Metric): 1608; Case/Package: 0603; Packaging: Tape and Reel; Number of Terminations: 2; Max Operating Temperature: 155°C; Radiation Hardening: No; Height: 0.45mm; Min Operating Temperature: -55°C; Contact Plating: Tin; Tolerance: 1%; Military Standard: Not; Depth: 0.85mm; Temperature Coefficient: 100ppm/°C; Width: 0.033inch; Composition: Thick Film
RDA1 RDA2 = CMP-2000-03097-2: RES Thick Film, 22Ω, 1%, 0.1W, 100ppm/°C, 0603; Voltage Rating: 75V; Power Rating: 100mW; Resistance: 22R; Lead Free: Lead Free; Height: 0.45mm; Package Quantity: 5000; Weight: 7.1E-05oz; Width: 0.85mm; Length: 1.55mm; Mount: Surface Mount; Packaging: Tape and Reel; Termination: SMD/SMT; Temperature Coefficient: 100ppm/°C; Case/Package: 0603; Case Code (Metric): 1608; Radiation Hardening: No; Max Operating Temperature: 155°C; Military Standard: Not; Min Operating Temperature: -55°C; Case Code (Imperial): 0603; Contact Plating: Tin; Voltage Rating (DC): 75V; Tolerance: 1%; Depth: 0.85mm; Composition: Thick Film
RESET_SW = CMP-08834-000003-1: SWITCH TACTILE SPST-NO 0.05A 24V; Manufacturer: Omron Electronics Inc-EMC Div; Contact Resistance: 100mΩ; Contact Current Rating: 50mA; Operating Force: 0.98N; Electromechanical Life: 1000000Cycles; Ambient Temperature Range Low: -25°C; Mount: Surface Mount; Package: 0; Lead Free: Yes; Temperature Range Low: -25°C; RoHS: TRUE; Throw Configuration: SPST-NO; Device Class L1: Electromechanical; Temperature Range High: +70°C; Voltage Rating Dc: 24V; ComponentLink2Description: Datasheet; Octopart: https://octopart.com/b3fs-1000p-omron-913849; Mouser Description: Tactile Switches 6X6X3.1mm 100gF TR; ComponentLink2URL: https://omronfs.omron.com/en_US/ecb/products/pdf/en-b3fs.pdf; Automotive: No; Device Class L3: Tactile Switches; Digikey Description: SWITCH TACTILE SPST-NO 0.05A 24V; Height: 3.3mm; Temperature: -25°C to +70°C; Category: Switch; Manufacturer Part Number: B3FS-1000P; Ambient Temperature Range High: +70°C; Device Class L2: Switches
RIND1 RIND2 RRESET = CMP-1012-00623-3: Chip Resistor, 10 KOhm, +/- 1%, 0.1 W, -55 to 155 degC, 0603 (1608 Metric), RoHS, Tape and Reel; Manufacturer: Panasonic; Voltage Rating: 75V; Case\/Package: 0603; Power Rating: 100mW; Resistance: 10KOhm; Temperature Coefficient: 100ppm\/degreesC; Number of Pins: 2; Package Reference: 603; Depth: 0.8mm; Mount: SurfaceMount; Package Description: 2-Pin Surface Mount Device, Body 1.6 x 0.85 mm; Datasheet Version: 02/2017; Length: 1.6mm; Lead Free: LeadFree; Height: 0.45mm; Number of Terminations: 2; Max Power Dissipation: 100mW; Min Operating Temperature: -55degC; Datasheet URL: https://industrial.panasonic.com/cdbs/www-data/pdf/RDA0000/AOA0000C304.pdf; Termination: SMD/SMT; Case Code (Metric): 1608; Case Code (Imperial): 0603; Tolerance: 1%; Max Operating Temperature: 155degC; RoHSCompliant: true; Voltage Rating (DC): 75V; Radiation Hardening: No; Packaging: TapeandReel; Composition: ThickFilm; Mounting Technology: SurfaceMount; Manufacturer URL: http://www.panasonic.com/; Width: 0.031inch; REACH SVHC: NoSVHC; Contact Plating: Tin; Military Standard: Not; Package Quantity: 1
RLEDR RLEDT RM8RXD RM8TXD = CMP-2000-00873-2: RES SMD 1K OHM 0.1% 1/10W 0603; Temperature Coefficient: 25ppm/°C; Voltage Rating: 75V; Max Power Dissipation: 100mW; Resistance: 1kR; Technology: METAL FILM; Number of Pins: 2; Packaging: Tape and Reel; Case Code (Imperial): 0603; Case Code (Metric): 1608; Min Operating Temperature: -55°C; REACH SVHC: No SVHC; Length: 1.6mm; Termination: SMD/SMT; Depth: 0.8mm; Resistance Tolerance: 0.1%; Number of Terminations: 2; Width: 0.8mm; Military Standard: Not; Tolerance: 0.1%; Package Quantity: 5000; Contact Plating: Tin; Height: 0.45mm; Construction: Rectangular; Case/Package: 0603; Max Operating Temperature: 155°C; Resistor Type: Thin Film; Series: ERA-3A; Size Code: 0603; RoHS Compliant: Yes; Mount: Surface Mount; Radiation Hardening: No; Power Rating: 100mW
RTAILLIGHT = CMP-2000-00195-2: RES SMD 10 OHM 1% 1/10W 0603; Manufacturer: Panasonic; Resistance: 10Ω; Voltage Rating: 75V; Value: 10Ω; Power: 100mW; Power Rating: 0.1W; Temperature Coefficient: 100ppm/°C; Automotive Grade: Grade 0; Lead Free: Yes; Device Class L1: Passive Components; Digikey Description: RES SMD 10 OHM 1% 1/10W 0603; Octopart: https://octopart.com/erj-3ekf10r0v-panasonic-55403649; Automotive: Yes; ComponentLink2URL: https://b2b-api.panasonic.eu/file_stream/pids/fileversion/1263; Manufacturer Part Number: ERJ-3EKF10R0V; Height: 0.55mm; Temperature Range High: +155°C; Footprint Url: https://industrial.panasonic.com/cdbs/www-data/pdf/RDA0000/DMA0000COL17.pdf; Temperature: -55°C to +155°C; Tolerance: 1%; ComponentLink2Description: Datasheet; Package: ERJ3EK; Device Class L2: Resistors; Category: Res; Ipc Land Pattern Name: RESC16080X45; RoHS: TRUE; Composition: Thick Film; Device Class L3: Chip SMD Resistors; Temperature Range Low: -55°C; Series: ERJ
RTESTLED = CMP-2000-03717-1: Manufacturer: Vishay Dale; Part Number: TNPW06031K00BEEA
SPI SPI2 = CMP-1502-01072-1: THT Vertical Pin Header WR-PHD, Pitch 2.54 mm, Dual Row, 6 pins; Manufacturer: Wurth Elektronik; Contact Resistance: 20mOhm; Withstanding Voltage: 500VAC; Pin Number: 6; Gender: Male; Pitch: 2.54mm; Working Voltage: 250VAC; Rated Current: 3A; Packaging: Bag; Row Number: Dual; Manufacturer URL: http://www.we-online.de; Part Number: 61300621121; Operating Temperature: -40to105degC; Mounting Technology: THT; Package Reference: 61300621121; Datasheet URL: https://katalog.we-online.de/em/datasheet/6130xx21121.pdf; Orientation: Vertical; Publisher: WurthElektronik
TESTLED = CMP-1426-00005-1: SMD mono-color Chip LED, WL-SMCW, Yellow; PartNumber: 150060YS75000; Manufacturer: Wuerth Elektronik; ComponentLink1URL: http://www.we-online.com; Color: Yellow; ComponentLink2Description: Datasheet; ComponentLink2URL: http://katalog.we-online.com/led/datasheet/150060YS75000.pdf; ComponentLink1Description: Manufacturer URL; PackageReference: 0603_A
TOFs = Header 7: Header, 7-Pin; LatestRevisionDate: 17-Jul-2002; LatestRevisionNote: Re-released for DXP Platform.; Publisher: Altium Limited
USB = CMP-2000-05827-1: Micro-USB B Receptacle, Right Angle, Bottom Mount, Surface Mount, with Solder Tabs, -30 to 85 degC, 5-Pin USB, RoHS, Tape and Reel; Manufacturer: Molex; Featured Product: Micro-USBConnectorsUSBConnectors; Other Names: WM1399DKR; Package Version: Rev. F, 12/2012; Number of Contacts: 5; Connector Type: USB-microB; Catalog Drawings: 1050170001; 3D Model: 105017-0001.stp; Mating Products: WM17145-ND-CABLEMICROUSBBTOSTDA1.0MWM17147-ND-CABLEMICROUSBBTOSTDA2.0MWM17146-ND-CABLEMICROUSBBTOSTDA1.5M; PCN Assembly/Origin: ResinSupplier21/Oct/2015; Voltage - Max: 30V; Online Catalog: Molex-MicroUSB; Manufacturer URL: http://www.molex.com/; Package Description: 5-Leads USB, Micro B, Body 7.5 x 5 mm, Pitch 0.65 mm; Datasheet URL: http://www.molex.com/elqNow/elqRedir.htm?ref=http://www.molex.com/webdocs/datasheets/pdf/en-us/1050170001_IO_CONNECTORS.pdf; Ingress Protection: -; Datasheet Version: 03/2016; Mounting Type: BoardCutout,SurfaceMount,RightAngle; Circuits: 5; Standard Package: 1; Package Reference: MICRO-B; Package URL: http://www.molex.com/pdm_docs/sd/1050170001_sd.pdf; Category: Connectors,Interconnects; Series: -; RoHS Information: 1050170001CertofCompliance; Features: Shielded,SolderRetention; Family: USB,DVI,HDMIConnectors; Specifications: -; Gender: Receptacle; Packaging: Digi-Reel®; Mounting Technology: SurfaceMount
USBChip = CMP-0095-00216-3: 8-bit AVR Microcontroller, 2.7-5.5V, 8KB Flash, 512 Bytes EEPROM, 512 Bytes SRAM, 32-pin TQFP, Industrial Grade (-40°C to 85°C); ComponentLink2Description: ATmega8U2/16U2/32U2 Datasheet; PackageDescription: 32-Lead, 7x7x1.0 mm Body, 0.8mm Lead Pitch, Thin Profile Plastic Quad Flat Package (TQFP); ComponentLink2URL: http://www.atmel.com/dyn/resources/prod_documents/doc7799.pdf; PackageVersion: revC, Oct-2010; RevisionNote: Schematic symbol corrected; ComponentLink3Description: ATmega8U2/16U2/32U2 Summary; DatasheetVersion: revD, Nov-2010; ComponentLink1Description: Manufacturer URL; PackageReference: 32A; PartNumber: ATmega8U2-AU; ComponentLink1URL: http://www.atmel.com/; Code_JEDEC: MS-026-ABA; ComponentLink3URL: http://www.atmel.com/dyn/resources/prod_documents/7799S.pdf
X Y1 = CMP-1749-00003-1: Resistance Weld Thru-Hole Crystal, 16 MHz, -20 to 70 degC, 2-Pin THD, RoHS, Bulk; Voltage Rating: 250 V; Tolerance: 1%; Resistance: 221 kohm; Case\Package: Axial; Power Rating: 250 mW; RoHSCompliant: true; Package Quantity: 200; Packaging: Bulk; Min Operating Temperature: -55 degC; DatasheetVersion: Mar-15; ComponentLink1URL: http://www.foxonline.com/; Max Operating Temperature: 155 degC; PackageReference: FOXSLF160-20; Mount: Through Hole; PackageDescription: 2-Pin Through Hole Device, Body 11.35 x 4.65 mm; ComponentLink1Description: Manufacturer URL; ComponentLink2URL: http://www.foxonline.com/pdfs/hc49slf.pdf; ComponentLink2Description: Datasheet; Length: 0.248 inch